# Altium schematic sheet ISOLATED PSU.SchDoc
size A4
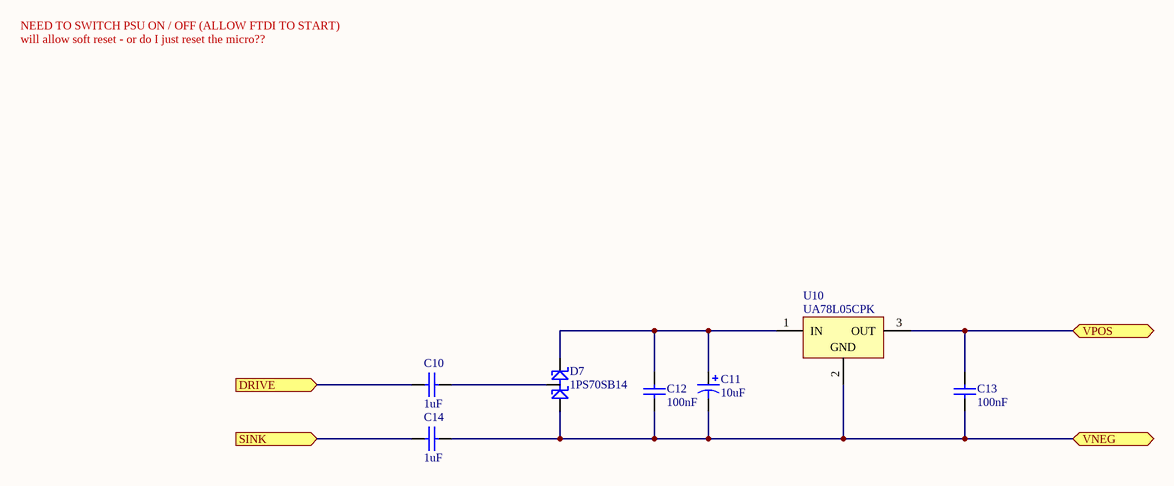
[diagram p0: ISOLATED PSU.SchDoc]

## Parts
C10  1uF  [RES (3D) - 1210]
C11  10uF  [CAP ELECTRO SIZE-B]
C12  100nF  [CAP (3D) - 0603]
C13  100nF  [CAP (3D) - 0603]
C14  1uF  [RES (3D) - 1210]
D7  1PS70SB14  [SOT23-3L]
U10  UA78L05CPK  [SOT89]

## Ports
DRIVE (in), SINK (in), VNEG (bidir), VPOS (bidir)

## Nets
DRIVE: C10.1 ; port DRIVE
SINK: C14.1 ; port SINK
VNEG: C11.2 C12.1 C13.1 C14.2 D7.1(A1) U10.2(GND) ; port VNEG
VPOS: C13.2 U10.3(OUT) ; port VPOS
NetC10_2: C10.2 D7.3(C1/A2)
NetC11_1: C11.1 C12.2 D7.2(C2) U10.1(IN)

## Notes on the sheet
- NEED TO SWITCH PSU ON / OFF (ALLOW FTDI TO START)
- will allow soft reset - or do I just reset the micro??

## Library data of the parts
C10 C14 = CAP: CAPACITOR SMD 0603; Manufacturer: Vishay; Manufacturer Part No.: VJ1206V105MXATW1BC; value: 1uF; Mouser Part no.: 77-VJ1206V105MXATBC; Web link: http://au.mouser.com/ProductDetail/Vishay-Vitramon/VJ1206V105MXATW1BC/?qs=sGAEpiMZZMsh%252b1woXyUXj%2f5vVgHgQOtXd6kjM69bn8k%3d
C11 = Cap Pol1: Polarized Capacitor (Radial); Value: 10uF
C12 C13 = Cap: Capacitor; Value: 100nF; Supplier 1: Mouser; Supplier 2: Digi-Key; Supplier Part Number 1: 603-C0603ZRY5V9BB104; Supplier Part Number 2: 311-1343-2-ND
D7 = 1PS70SB14: DUAL DIODE, SCHOTTKY; Manufacturer: NXP SEMICONDUCTORS; Manufacturer Part No.: 1PS70SB14,115; Mouser Part no.: 771-1PS70SB14115; PackageReference: SOT-23; value: 1PS70SB14; Web link: http://au.mouser.com/ProductDetail/NXP/1PS70SB14115/?qs=%2fha2pyFaduilAAyL24tUzZnn4tsMeHrtxaD3Jd8jZKE%3d
U10 = UA78L05CPK: 3-Terminal Positive Fixed Voltage Regulator; Manufacturer: Texas Instruments; Value: 78L05; Mouser Part No.: 595-UA78L05CPK; Manufacturer Part No.: UA78L05CPK; Web link: http://au.mouser.com/ProductDetail/Texas-Instruments/UA78L05CPK/?qs=sGAEpiMZZMug9GoBKXZ752zpfzgkUxVv6JK8yg2x40A%3d